# EAGLE design REV3 (EAGLE 8.7.0)
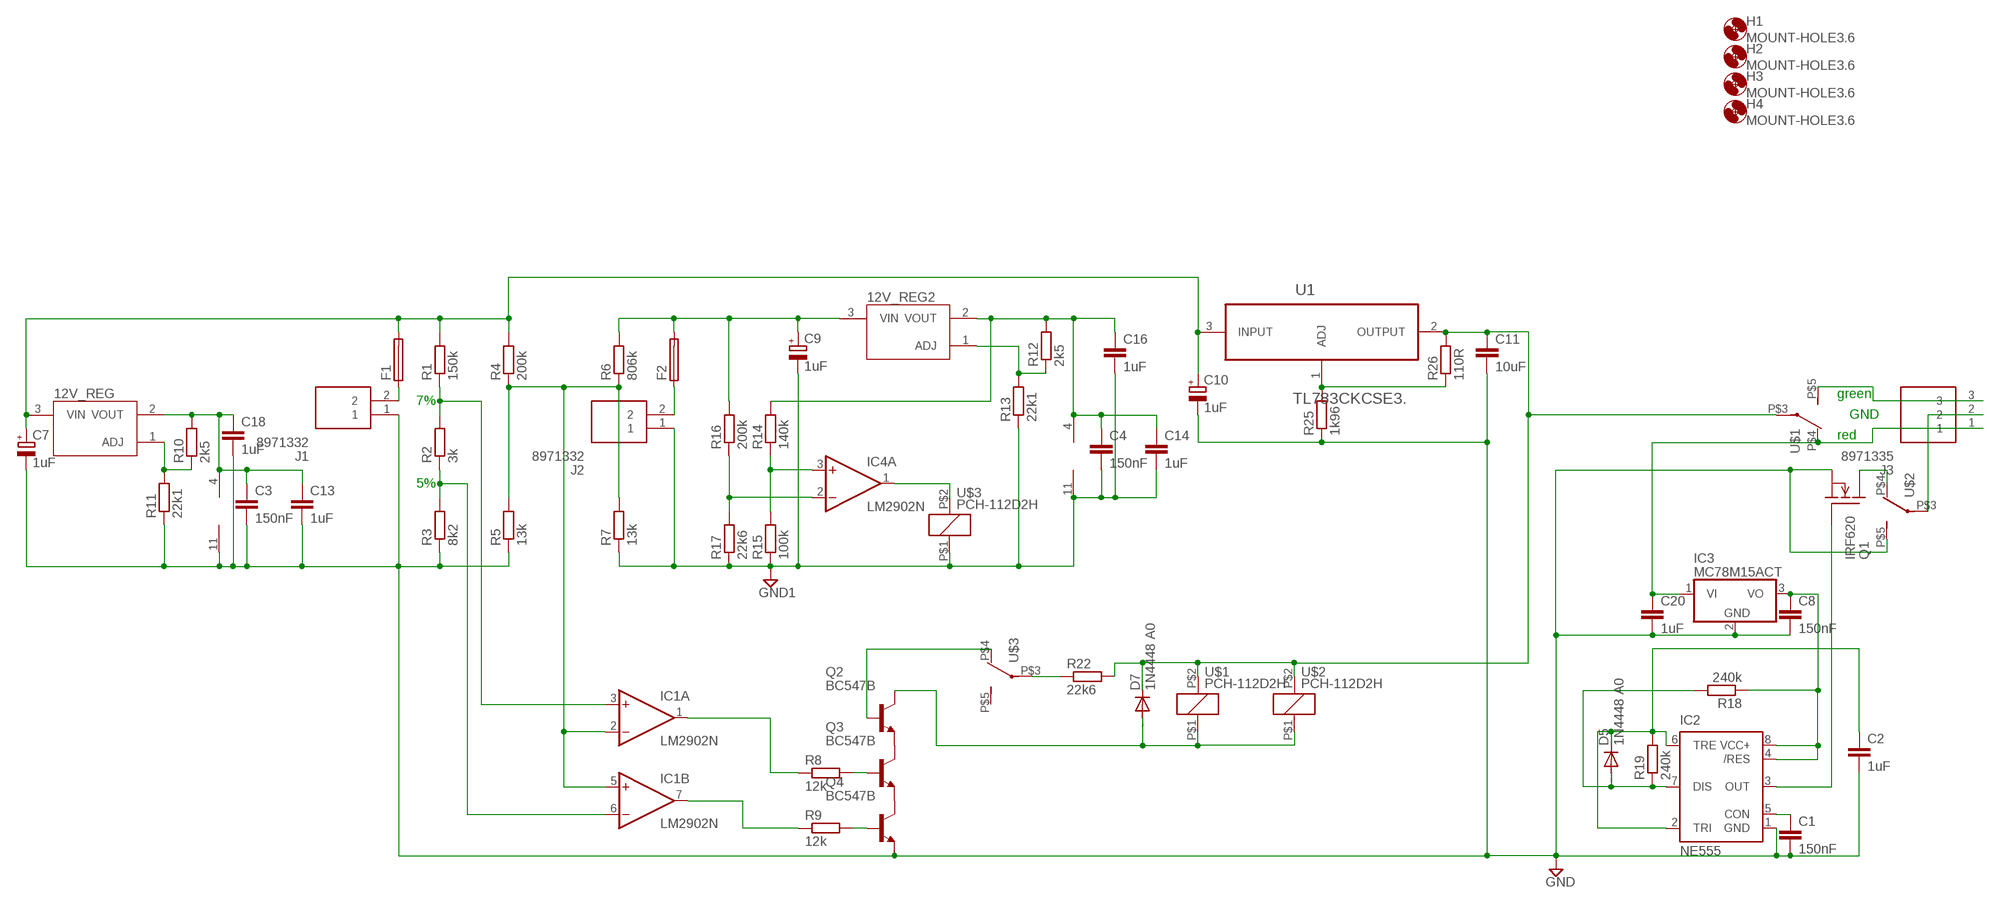
[diagram p0: schematic, sheet 1]

## Parts
12V_REG  LR8LR8  [TO92-LINE]
12V_REG2  LR8LR8  [TO92-LINE]
C1  150nF  C-EU050-024X044  [C050-024X044]
C2  1uF  C-EU025-030X050  [C025-030X050]
C3  150nF  C-EU050-024X044  [C050-024X044]
C4  150nF  C-EU050-024X044  [C050-024X044]
C7  1uF  CPOL-EUE3.5-8  [E3,5-8]
C8  150nF  C-EU050-024X044  [C050-024X044]
C9  1uF  CPOL-EUE3.5-8  [E3,5-8]
C10  1uF  CPOL-EUE3.5-8  [E3,5-8]
C11  10uF  C-EU050-075X075  [C050-075X075]
C13  1uF  C-EU025-030X050  [C025-030X050]
C14  1uF  C-EU025-030X050  [C025-030X050]
C16  1uF  C-EU025-030X050  [C025-030X050]
C18  1uF  C-EU025-030X050  [C025-030X050]
C20  1uF  C-EU025-030X050  [C025-030X050]
D5  1N4448 A0  1N4446  [DO35-10]
D7  1N4448 A0  1N4446  [DO35-10]
F1  GSH15  [GSH15]
F2  GSH15  [GSH15]
H1  MOUNT-HOLE3.6  [3,6]
H2  MOUNT-HOLE3.6  [3,6]
H3  MOUNT-HOLE3.6  [3,6]
H4  MOUNT-HOLE3.6  [3,6]
IC1  LM2902N  [DIL14]
IC2  NE555  [DIL-08]
IC3  MC78M15ACT  [TO220V]
IC4  LM2902N  [DIL14]
J1  8971332  [SHDR2W90P0X350_1X2_700X700X850]
J2  8971332  [SHDR2W90P0X350_1X2_700X700X850]
J3  8971335  [SHDR3W90P0X350_1X3_1050X700X85]
Q1  IRF620  [TO220]
Q2  BC547B  [TO92]
Q3  BC547B  [TO92]
Q4  BC547B  [TO92]
R1  150k  R-EU_0207/10  [0207/10]
R2  3k  R-EU_0207/10  [0207/10]
R3  8k2  R-EU_0207/10  [0207/10]
R4  200k  R-EU_0207/10  [0207/10]
R5  13k  R-EU_0207/10  [0207/10]
R6  806k  R-EU_0207/10  [0207/10]
R7  13k  R-EU_0207/10  [0207/10]
R8  12k  R-EU_0207/10  [0207/10]
R9  12k  R-EU_0207/10  [0207/10]
R10  2k5  R-EU_0207/10  [0207/10]
R11  22k1  R-EU_0207/10  [0207/10]
R12  2k5  R-EU_0207/10  [0207/10]
R13  22k1  R-EU_0207/10  [0207/10]
R14  140k  R-EU_0207/10  [0207/10]
R15  100k  R-EU_0207/10  [0207/10]
R16  200k  R-EU_0207/10  [0207/10]
R17  22k6  R-EU_0207/10  [0207/10]
R18  240k  R-EU_0207/10  [0207/10]
R19  240k  R-EU_0207/10  [0207/10]
R22  22k6  R-EU_0207/10  [0207/10]
R25  1k96  R-EU_0309/10  [0309/10]
R26  110R  R-EU_0309/10  [0309/10]
U1  TL783CKCSE3.  [TO254P457X1016X2222-3P]
U$1  PCH-112D2H  [PCH-112D2H]
U$2  PCH-112D2H  [PCH-112D2H]
U$3  PCH-112D2H  [PCH-112D2H]

## Nets
GND: C1.2 C2.2 C3.2 C7.- C8.2 C10.- C11.2 C13.2 C18.2 C20.2 IC1.11(P:V-) IC2.1(GND) IC3.2(GND) J1.1 Q1.3(S) Q4.1(E) R3.1 R5.1 R11.1 R25.1 U$2.P$5(S)
GND1: C4.2 C9.- C14.2 C16.2 IC4.11(P:V-) J2.1 R7.1 R13.1 R15.1 R17.1 U$3.P$1
N$1: 12V_REG.3(VIN) C7.+ C10.+ F1.2 R1.2 R4.2 U1.3(INPUT)
N$2: Q3.1(E) Q4.3(C)
N$3: IC1.2(A:-IN) IC1.5(B:+IN) R4.1 R5.2 R6.1 R7.2
N$4: C11.1 D7.C R22.2 R26.2 U1.2(OUTPUT) U$1.P$2 U$1.P$3(P) U$2.P$2
N$5: 12V_REG2.3(VIN) C9.+ F2.2 R6.2 R16.2
N$6: IC2.3(OUT) Q1.1(G)
N$7: F1.1 J1.2
N$8: IC4.1(A:OUT) U$3.P$2
N$9: 12V_REG.2(VOUT) C3.1 C13.1 C18.1 IC1.4(P:V+) R10.2
N$10: 12V_REG.1(ADJ) R10.1 R11.2
N$11: J3.3 U$1.P$5(S)
N$12: Q1.2(D) U$2.P$4(O)
N$13: Q3.2(B) R8.2
N$14: F2.1 J2.2
N$15: C1.1 IC2.5(CON)
N$16: D5.A IC2.7(DIS) R18.2 R19.1
N$17: C20.1 IC3.1(VI) J3.1 U$1.P$4(O)
N$18: C2.1 D5.C IC2.2(TRI) IC2.6(TRE) R19.2
N$19: C8.1 IC2.4(/RES) IC2.8(VCC+) IC3.3(VO) R18.1
N$20: IC4.2(A:-IN) R16.1 R17.2
N$22: 12V_REG2.2(VOUT) C4.1 C14.1 C16.1 IC4.4(P:V+) R12.2 R14.2
N$24: IC4.3(A:+IN) R14.1 R15.2
N$25: 12V_REG2.1(ADJ) R12.1 R13.2
N$26: Q4.2(B) R9.2
N$27: IC1.3(A:+IN) R1.1 R2.2
N$28: IC1.6(B:-IN) R2.1 R3.2
N$29: R25.2 R26.1 U1.1(ADJ)
N$30: IC1.7(B:OUT) R9.1
N$31: IC1.1(A:OUT) R8.1
N$33: J3.2 U$2.P$3(P)
N$34: D7.A Q2.3(C) U$1.P$1 U$2.P$1
N$36: Q2.1(E) Q3.3(C)
N$38: Q2.2(B) U$3.P$4(O)
N$39: R22.1 U$3.P$3(P)
Unconnected: IC1.8(C:OUT) IC1.9(C:-IN) IC1.10(C:+IN) IC1.12(D:+IN) IC1.13(D:-IN) IC1.14(D:OUT) IC4.5(B:+IN) IC4.6(B:-IN) IC4.7(B:OUT) IC4.8(C:OUT) IC4.9(C:-IN) IC4.10(C:+IN) IC4.12(D:+IN) IC4.13(D:-IN) IC4.14(D:OUT) U$3.P$5(S)

## Notes on the sheet
- green
- 7%
- GND
- red
- 5%

## Library data of the parts
12V_REG 12V_REG2 = LR8N3-G:LR8
C1-C4 C8 C11 C13 C14 C16 C18 C20 = rcl:C-EU: CAPACITOR, European symbol; SPICEPREFIX: C
C7 C9 C10 = rcl:CPOL-EU: POLARIZED CAPACITOR, European symbol; SPICEPREFIX: C
D5 D7 = diode:1N4446: DIODE high speed (Philips)
F1 F2 = fuse:GSH15: FUSE HOLDER grid 15mm, 19649 Wickmann; MPN: 64900001039; OC_FARNELL: 1271673; OC_NEWARK: 02P0318
H1-H4 = holes:MOUNT-HOLE: MOUNTING HOLE with drill center marker
IC1 IC4 = linear:LM2902: Low power quad operational amplifier Source: Data sgeet <http://www.st.com/internet/com/TECHNICAL_RESOURCES/TECHNICAL_LITERATURE/DATASHEET/CD00000533.pdf>
IC2 = st-microelectronics:NE555: General purpose bipolar Timer; MF: Arrow Electronics; MPN: NE555N; OC_FARNELL: 1467742; OC_NEWARK: 89K1486
IC3 = linear:MC78M: 500 mA Positive Voltage Regulators Source: Data sheet <http://www.onsemi.com/pub_link/Collateral/MC78M00-D.PDF>
J1 J2 = SamacSys_Parts:8971332: RS Pro 3.5mm Pitch Straight PCB Terminal Block with Screw Termination, PCB Mount, 2 Way Source: Datasheet <http://uk.rs-online.com/web/p/products/8971332>; ARROW_PART_NUMBER: 8971332; ARROW_PRICE/STOCK: http://uk.rs-online.com/web/p/products/8971332; DESCRIPTION: RS Pro 3.5mm Pitch Straight PCB Terminal Block with Screw Termination, PCB Mount, 2 Way; HEIGHT: 8.5mm; MANUFACTURER_NAME: RS Components; MANUFACTURER_PART_NUMBER: 8971332; RS_PART_NUMBER: 8971332; RS_PRICE/STOCK: http://uk.rs-online.com/web/p/products/8971332
J3 = SamacSys_Parts:8971335: 3.5mm U/low prof PCB terminal block,3P Source: Datasheet <http://docs-asia.electrocomponents.com/webdocs/157d/0900766b8157d678.pdf>; DESCRIPTION: 3.5mm U/low prof PCB terminal block,3P; HEIGHT: 8.5mm; MANUFACTURER_NAME: RS Components; MANUFACTURER_PART_NUMBER: 8971335; RS_PART_NUMBER: 8971335
Q1 = transistor-fet:IRF620: N-Channel Enhancement MOSFET (HEXFET); 200V; 5,2A; 0,8Ohm
Q2-Q4 = transistor-npn:BC547*: NPN Transistor
R1-R19 R22 R25 R26 = rcl:R-EU_: RESISTOR, European symbol; SPICEPREFIX: R
U1 = TL783CKCSE3:TL783CKCSE3.: IC,HIGH-VOLTAGE ADJUSTABLE REGULATOR,TO220-3; MPN: TL783CKCSE3.; OC_FARNELL: 1703396; OC_NEWARK: 10M0615; PACKAGE: TO220-3; SUPPLIER: TEXAS INSTRUMENTS
U$1-U$3 = PCH-112D2H:PCH-112D2H

## Board
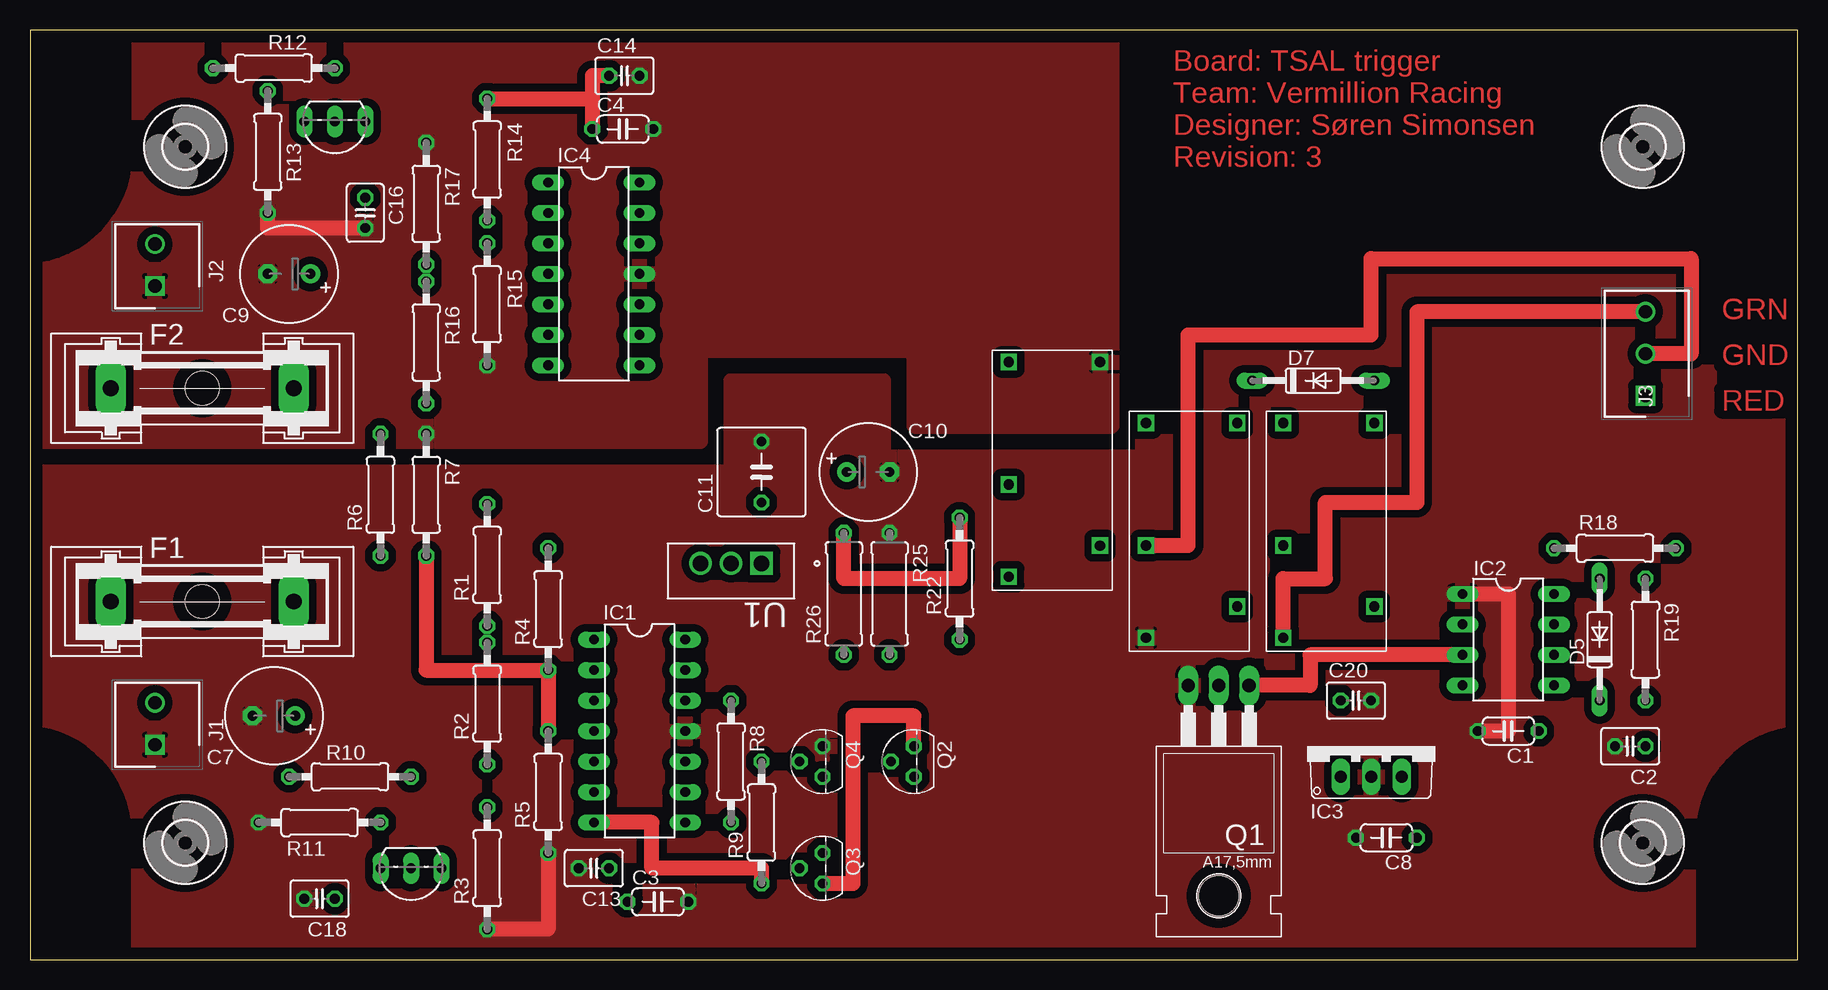
[diagram p1: board, top side]
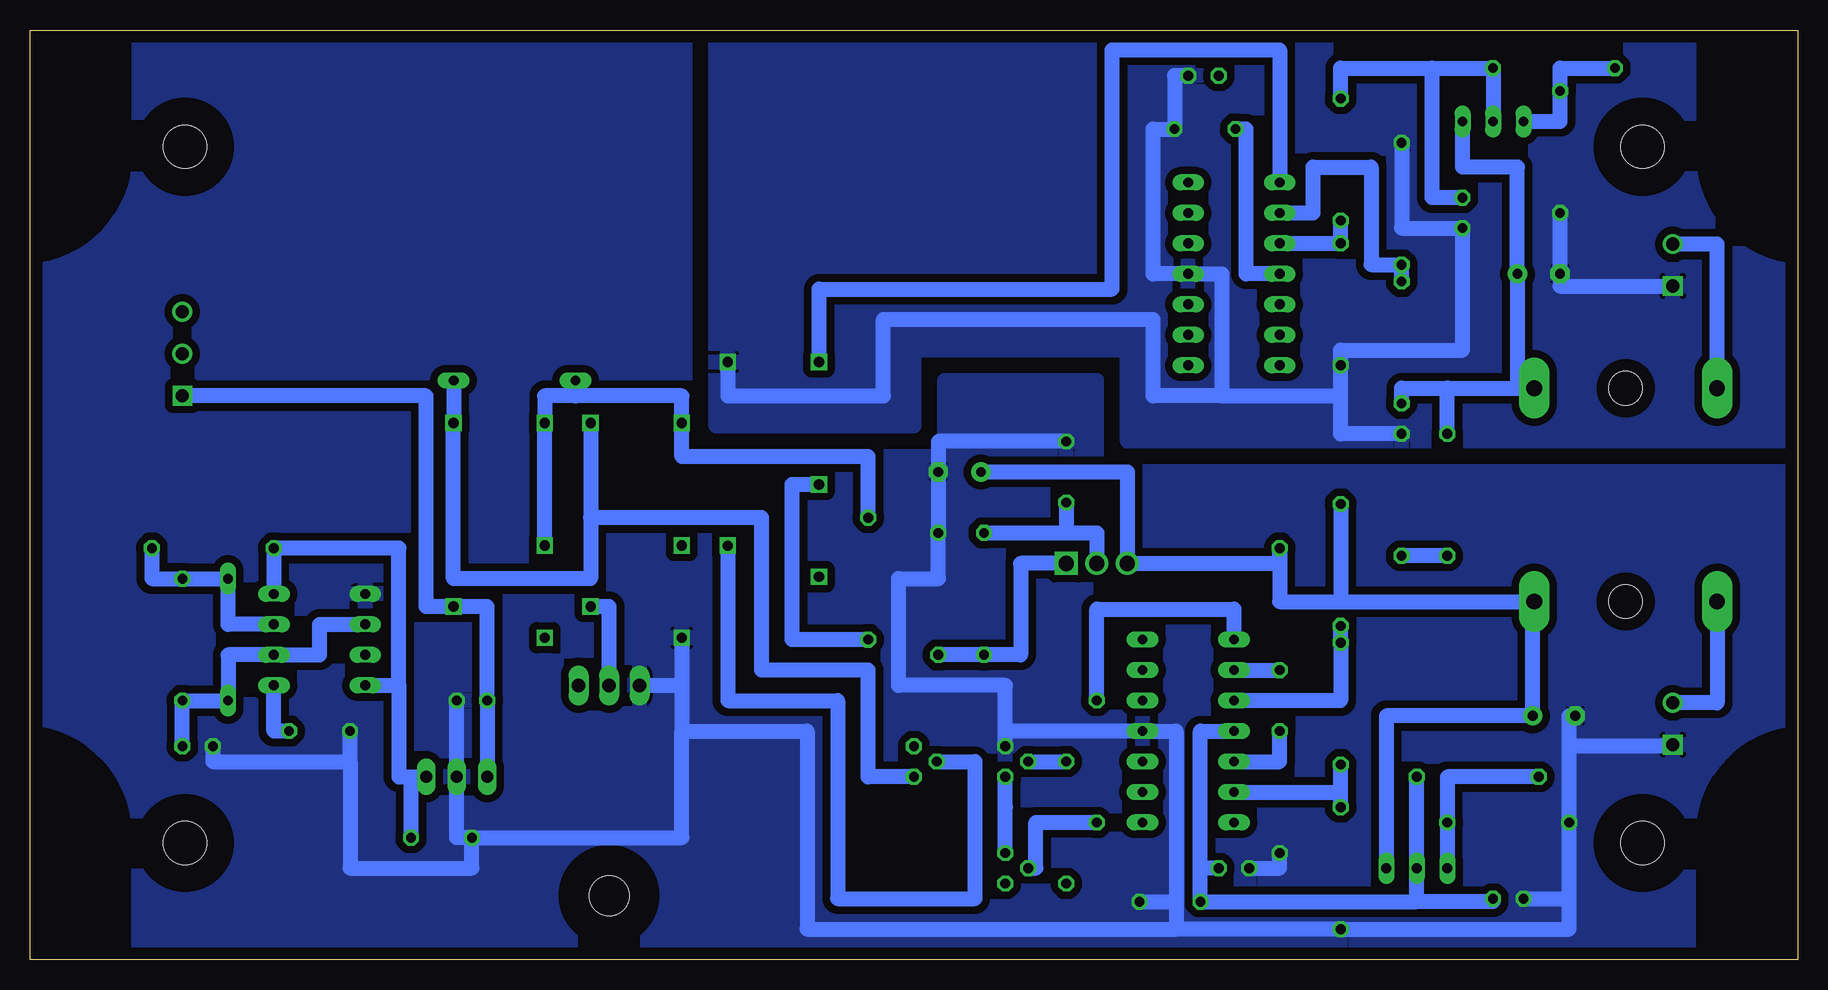
[diagram p2: board, bottom side, seen from below]

Size 147.32 x 77.47 mm. Coordinates in mm from the lower left corner, seen from the top.
Outline: 0,0 147.32,0 147.32,77.47 0,77.47 0,0
Copper layers (1*16): Top 0.035mm / dielectric 1.5mm / Bottom 0.035mm
Design rules "default *": minimum track width 6mil, minimum drill 0.35mm, track to track 25mil, track to pad 25mil, pad to pad 25mil, via to via 25mil, smd to smd 25mil, copper to edge 40mil, drill to drill 6mil, minimum pad ring 10mil, minimum via ring 8mil, stop-mask expansion 4mil, vias tented up to drill 0mil, thermal gap 10mil

### Footprints (pad centres in the part's own frame; a part is rotated, then mirrored left to right if it is on the bottom)
TO92-LINE = drill 0.813 long: 1 2.54,0; 2 0,0; 3 -2.54,0
C050-024X044 = drill 0.813 octagon: 1 -2.54,0; 2 2.54,0
C025-030X050 = drill 0.813 octagon: 1 -1.27,0; 2 1.27,0
E3,5-8 = drill 0.813 pad 1.6: + -1.778,0 | drill 0.813 pad 1.6 octagon: - 1.778,0
C050-075X075 = drill 0.813 octagon: 1 -2.54,0; 2 2.54,0
DO35-10 = drill 0.813 long: A 5.08,0; C -5.08,0
GSH15 = drill 1.321 pad 2.54 long: 1 -7.62,0; 2 7.62,0 | hole 2.794: 0,0
3,6 = hole 3.6: 0,0
DIL14 = drill 0.813 long: 1 -7.62,-3.81; 2 -5.08,-3.81; 3 -2.54,-3.81; 4 0,-3.81; 5 2.54,-3.81; 6 5.08,-3.81; 7 7.62,-3.81; 8 7.62,3.81; 9 5.08,3.81; 10 2.54,3.81; 11 0,3.81; 12 -2.54,3.81; 13 -5.08,3.81; 14 -7.62,3.81
DIL-08 = drill 0.813 long: 1 -3.81,-3.81; 2 -1.27,-3.81; 3 1.27,-3.81; 4 3.81,-3.81; 5 3.81,3.81; 6 1.27,3.81; 7 -1.27,3.81; 8 -3.81,3.81
TO220V = drill 1.016 long: 1 -2.54,-2.54; 2 0,-2.54; 3 2.54,-2.54
SHDR2W90P0X350_1X2_700X700X850 = drill 1.1 pad 1.65 square: 1 0,0 | drill 1.1 pad 1.65: 2 3.5,0
SHDR3W90P0X350_1X3_1050X700X85 = drill 1.1 pad 1.65 square: 1 0,0 | drill 1.1 pad 1.65: 2 3.5,0; 3 7,0
TO220 = drill 1.118 long: 1 -2.54,-6.35; 2 0,-6.35; 3 2.54,-6.35 | hole 3.302: 0,11.176
TO92 = drill 0.813 octagon: 1 1.27,0; 2 0,1.905; 3 -1.27,0
0207/10 = drill 0.813 octagon: 1 -5.08,0; 2 5.08,0
0309/10 = drill 0.813 octagon: 1 -5.08,0; 2 5.08,0
TO254P457X1016X2222-3P = drill 1.27 square: 1 -5.08,-1.27 | drill 1.27: 2 -2.54,-1.27; 3 0,-1.27
PCH-112D2H = drill 0.85 square: P$1 19.32,1; P$2 19.32,8.6; P$3 9.12,8.6; P$4 4.02,1; P$5 1.42,8.6

### Placement (x,y rotation side)
12V_REG  31.75,7.62 180 top
12V_REG2  25.4,69.85 180 top
C1  123.19,19.05 180 top
C2  133.35,17.78 180 top
C3  52.32,4.83 0 top
C4  49.4,69.22 0 top
C7  20.32,20.32 180 top
C8  113.03,10.16 180 top
C9  21.59,57.15 180 top
C10  69.85,40.64 0 top
C11  60.96,40.64 90 top
C13  46.99,7.62 180 top
C14  49.53,73.66 0 top
C16  27.94,62.23 270 top
C18  24.13,5.08 180 top
C20  110.49,21.59 0 top
D5  130.81,26.67 90 top
D7  106.93,48.26 0 top
F1  14.35,29.84 0 top
F2  14.35,47.62 0 top
H1  12.93,67.74 0 top
H2  12.93,9.73 0 top
H3  134.39,9.73 0 top
H4  134.39,67.74 0 top
IC1  50.8,19.05 270 top
IC2  123.19,26.67 270 top
IC3  111.76,17.78 0 top
IC4  46.99,57.15 270 top
J1  10.41,17.91 90 top
J2  10.41,56.13 90 top
J3  134.62,46.99 90 top
Q1  99.06,16.51 180 top
Q2  73.66,16.51 90 top
Q3  66.04,7.62 90 top
Q4  66.04,16.51 90 top
R1  38.1,32.89 90 top
R2  38.1,21.34 90 top
R3  38.1,7.62 90 top
R4  43.18,29.21 90 top
R5  43.18,13.97 90 top
R6  29.21,38.73 90 top
R7  33.02,38.73 270 top
R8  58.42,16.51 270 top
R9  60.96,11.43 90 top
R10  26.67,15.24 0 top
R11  24.13,11.43 0 top
R12  20.32,74.3 0 top
R13  19.81,67.31 90 top
R14  38.1,66.67 90 top
R15  38.1,54.61 90 top
R16  33.02,51.44 270 top
R17  33.02,62.99 270 top
R18  132.08,34.29 0 top
R19  134.62,26.67 270 top
R22  77.47,31.75 90 top
R25  71.63,30.48 270 top
R26  67.82,30.48 90 top
U1  55.88,31.75 180 top
U$1  113.03,25.4 90 top
U$2  101.6,25.4 90 top
U$3  90.17,30.48 90 top

### Tracks (layer width: path | path; a pad name or v marks a point on that pad's centre or on a via)
GND
  Top 1.27: R5.1 43.18,2.54 R3.1 | IC2.1 123.19,30.48 123.19,19.05 C1.2
  Bottom 1.27: 19.05,17.78 R11.1 19.05,5.08 | 19.05,17.78 19.05,20.32 C7.- | J1.1 10.41,17.78 19.05,17.78 | 19.05,5.08 19.05,2.54 R3.1 51.82,2.54 | 51.82,4.83 51.82,19.05 IC1.11 66.04,19.05 | 51.82,4.83 51.82,2.54 | Q4.1 66.04,19.05 | C11.2 71.63,43.18 C10.- R25.1 71.63,31.75 74.93,31.75 74.93,22.86 66.04,22.86 66.04,19.05 | U$2.P$5 93,22.86 | 93,22.86 93,19.05 | 93,19.05 82.55,19.05 82.55,2.54 51.82,2.54 | C13.2 43.18,7.62 R5.1 | C3.2 51.82,4.83 | C18.2 19.05,5.08 | Q1.3 93,22.86 | C20.2 IC3.2 111.76,10.16 C8.2 | C8.2 93,10.16 93,19.05 | C2.2 132.08,16.51 120.65,16.51 | 120.65,16.51 C1.2 | 120.65,16.51 120.65,7.62 110.49,7.62 C8.2
  pour Top: 92.71,78.74 148.59,78.74 148.59,-1.27 -2.54,-1.27 -2.54,40.64 58.42,40.64 58.42,48.26 71.12,48.26 71.12,41.91 92.71,41.91
  pour Bottom: -2.54,40.64 58.42,40.64 58.42,48.26 71.12,48.26 71.12,41.91 92.71,41.91 92.71,78.74 148.59,78.74 148.59,-1.27 -2.54,-1.27
GND1
  Top 1.27: C16.2 19.81,60.96 R13.1
  Bottom 1.27: J2.1 19.81,56.13 C9.- R13.1 | C14.2 51.94,73.66 C4.2 53.72,69.22 53.72,57.15 IC4.11 48.01,57.15 48.01,46.99 | 48.01,46.99 38.1,46.99 | 38.1,46.99 R15.1 38.1,50.8 27.94,50.8 C16.2 33.02,60.96 R17.1 | R7.1 38.1,43.81 38.1,46.99 | U$3.P$1 89.17,46.99 76.2,46.99 76.2,53.34 53.72,53.34 53.72,46.99 48.01,46.99
  pour Top: -2.54,78.74 -2.54,43.18 55.88,43.18 55.88,50.8 73.66,50.8 73.66,44.45 90.17,44.45 90.17,78.74
  pour Bottom: -2.54,43.18 55.88,43.18 55.88,50.8 73.66,50.8 73.66,44.45 90.17,44.45 90.17,78.74 0,78.74 -2.54,78.74
N$1
  Bottom 1.27: 22.1,29.84 C7.+ 34.29,20.32 12V_REG.3 | 22.1,29.84 F1.2 | R1.2 38.1,29.84 | 38.1,29.84 22.1,29.84 | 38.1,29.84 43.18,29.84 R4.2 43.18,33.02 U1.3 55.88,40.64 C10.+
N$2
  Bottom 1.27: Q3.1 66.04,12.7 Q4.3
N$3
  Top 1.27: R5.2 R4.1 33.02,24.13 R7.2
  Bottom 1.27: R6.1 R7.2 | IC1.5 43.18,16.51 R5.2 | IC1.2 R4.1
N$4
  Top 1.27: R22.2 77.47,31.75 67.82,31.75 R26.2
  Bottom 1.27: 101.85,46.99 93,46.99 U$2.P$2 93,41.91 77.47,41.91 R22.2 | 101.85,46.99 104.43,46.99 U$1.P$2 U$1.P$3 | D7.C 101.85,46.99 | R26.2 60.96,35.56 | 60.96,35.56 58.42,35.56 U1.2 | C11.1 60.96,35.56
N$5
  Bottom 1.27: 12V_REG2.3 27.94,66.04 23.37,66.04 C9.+ 23.37,47.62 | 23.37,47.62 F2.2 | R16.2 33.02,47.62 29.21,47.62 | 29.21,47.62 23.37,47.62 | R6.2 29.21,47.62
N$6
  Top 1.27: Q1.1 106.68,22.86 106.68,25.4 IC2.3
N$7
  Bottom 1.27: F1.1 6.73,21.41 J1.2
N$8
  Bottom 1.27: IC4.1 43.18,75.82 57.15,75.82 57.15,55.88 81.57,55.88 U$3.P$2
N$9
  Bottom 1.27: R10.2 12V_REG.2 31.75,4.83 | IC1.4 49.78,19.05 49.78,7.62 | C13.1 49.78,7.62 | 31.75,4.83 C3.1 49.78,7.62 | C18.1 25.4,4.83 31.75,4.83
N$10
  Bottom 1.27: 12V_REG.1 R11.2 29.21,15.24 R10.1
N$11
  Top 1.27: J3.3 115.57,53.99 115.57,38.1 107.95,38.1 107.95,31.75 104.43,31.75 U$1.P$5
N$12
  Bottom 1.27: Q1.2 99.06,29.42 U$2.P$4
N$13
  Bottom 1.27: Q3.2 63.5,7.62 63.5,11.43 R8.2
N$14
  Bottom 1.27: F2.1 6.73,59.63 J2.2
N$15
  Bottom 1.27: C1.1 127,19.05 IC2.5
N$16
  Bottom 1.27: IC2.7 130.81,27.94 D5.A R19.1 137.16,31.75 R18.2
N$17
  Bottom 1.27: IC3.1 C20.1 109.22,29.42 U$1.P$4 114.3,29.42 114.3,46.99 J3.1
N$18
  Bottom 1.27: IC2.2 123.19,27.94 123.19,25.4 IC2.6 130.81,25.4 D5.C R19.2 C2.1
N$19
  Bottom 1.27: C8.1 115.57,15.24 | 115.57,15.24 IC3.3 | IC2.8 R18.1 116.59,34.29 116.59,22.86 | IC2.4 116.59,22.86 | 116.59,22.86 116.59,15.24 115.57,15.24
N$20
  Bottom 1.27: R16.1 R17.2 35.56,57.91 35.56,66.04 40.39,66.04 40.39,62.23 IC4.2
N$21
  cutout Top: 138.99,77.47 138.99,67.74 arc90 147.32,58.09 147.32,77.47
N$22
  Top 1.27: C14.1 46.86,73.66 46.86,71.75 | 46.86,71.75 C4.1 | R14.2 46.86,71.75
  Bottom 1.27: 12V_REG2.2 R12.2 30.48,74.3 | R14.2 38.1,74.3 30.48,74.3 | IC4.4 45.97,57.15 45.97,69.22 C4.1 | C16.1 30.48,63.5 30.48,74.3
N$23
  cutout Top: 138.99,0 138.99,9.73 arc-90 147.32,19.38 147.32,0
N$24
  Bottom 1.27: R14.1 R15.2 IC4.3
N$25
  Bottom 1.27: R12.1 19.81,74.3 R13.2 19.81,69.85 12V_REG2.1
N$26
  Bottom 1.27: Q4.2 R9.2
N$27
  Bottom 1.27: R1.1 R2.2 38.1,21.59 IC1.3
N$28
  Bottom 1.27: R3.2 38.1,13.97 | 38.1,13.97 R2.1 | IC1.6 38.1,13.97
N$29
  Bottom 1.27: R25.2 R26.1 64.77,25.4 64.77,33.02 U1.1
N$30
  Top 1.27: R9.1 60.96,7.62 51.82,7.62 51.82,11.43 IC1.7
N$31
  Bottom 1.27: R8.1 58.42,29.21 46.99,29.21 IC1.1
N$32
  cutout Top: 8.33,77.47 8.33,67.74 arc-90 0,58.09 0,77.47
N$33
  Top 1.27: U$2.P$3 96.52,34.52 96.52,52.07 111.76,52.07 111.76,58.42 138.43,58.42 138.43,50.49 J3.2
N$34
  Bottom 1.27: U$2.P$1 100.6,36.83 | 100.6,36.83 100.6,31.75 112.03,31.75 U$1.P$1 112.01,44.72 D7.A | Q2.3 77.47,15.24 77.47,24.13 86.36,24.13 86.36,36.83 100.6,36.83
N$35
  cutout Top: 0,0 8.33,0 8.33,9.73 arc90 0,19.38
N$36
  Top 1.27: Q3.3 68.58,6.35 68.58,20.32 73.66,20.32 Q2.1
N$37
  cutout Bottom: 8.33,77.47 8.33,67.74 arc-90 0,58.09 0,77.47
N$38
  Bottom 1.27: U$3.P$4 89.17,21.59 80.01,21.59 80.01,5.08 68.58,5.08 68.58,16.51 Q2.2
N$39
  Bottom 1.27: R22.1 83.82,26.67 83.82,39.6 U$3.P$3
N$40
  cutout Bottom: 0,0 8.33,0 8.33,9.73 arc90 0,19.38
N$41
  cutout Bottom: 138.99,0 138.99,9.73 arc-90 147.32,19.38 147.32,0
N$42
  cutout Top: 0,0 8.33,0 8.33,9.73 arc90 0,19.38
N$43
  cutout Bottom: 138.99,77.47 138.99,67.74 arc90 147.32,58.09 147.32,77.47
N$44
  cutout Top: 138.99,0 138.99,9.73 arc-90 147.32,19.38 147.32,0
N$45
  cutout Top: 0,0 8.33,0 8.33,9.73 arc90 0,19.38

### Text on the board
Top: Board: TSAL trigger / Team: Vermillion Racing / Designer: Søren Simonsen / Revision: 3 | GRN | GND | RED